# Altium schematic sheet keycontrol2.SchDoc
size A4
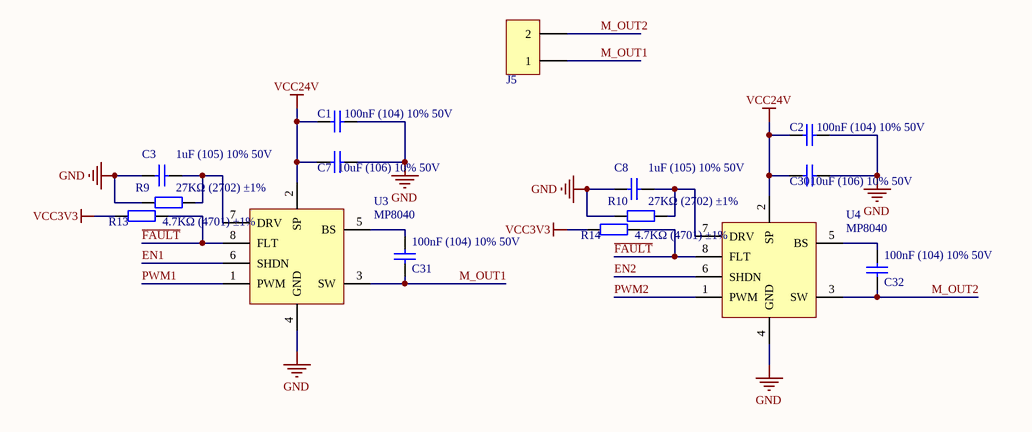
[diagram p0: keycontrol2.SchDoc]

## Parts
C1  100nF (104) 10% 50V  [0603_C]
C2  100nF (104) 10% 50V  [0603_C]
C3  1uF (105) 10% 50V  [0603_C]
C7  10uF (106) 10% 50V  [1206_C]
C8  1uF (105) 10% 50V  [0603_C]
C30  10uF (106) 10% 50V  [1206_C]
C31  100nF (104) 10% 50V  [0603_C]
C32  100nF (104) 10% 50V  [0603_C]
J5  MOTOR  [XH-2P]  (value not drawn)
R9  27KΩ (2702) ±1%  [0603_R]
R10  27KΩ (2702) ±1%  [0603_R]
R13  4.7KΩ (4701) ±1%  [0603_R]
R14  4.7KΩ (4701) ±1%  [0603_R]
U3  MP8040  [SOIC-8_150mil]
U4  MP8040  [SOIC-8_150mil]

## Nets
GND: C1.1 C2.1 C3.1 C7.2 C8.1 C30.2 R9.1 R10.1 U3.4(GND) U4.4(GND)
VCC3V3: R13.1 R14.1
VCC24V: C1.2 C2.2 C7.1 C30.1 U3.2(SP) U4.2(SP)
EN1: U3.6(SHDN)
EN2: U4.6(SHDN)
~{FAULT}: R13.2 R14.2 U3.8(FLT) U4.8(FLT)
M_OUT1: C31.1 J5.1 U3.3(SW)
M_OUT2: C32.1 J5.2 U4.3(SW)
PWM1: U3.1(PWM)
PWM2: U4.1(PWM)
NetC3_2: C3.2 R9.2 U3.7(DRV)
NetC8_2: C8.2 R10.2 U4.7(DRV)
NetC31_2: C31.2 U3.5(BS)
NetC32_2: C32.2 U4.5(BS)

## Library data of the parts
C1 C2 C31 C32 = 0603 100nF (104) 10% 50V: 贴片电容; ComponentLink1Description: 供应商链接; ComponentLink1URL: http://www.szlcsc.com/product/details_15331.html; Package: 0603; Supplier: LC; SuppliersPartNumber: C14663
C3 C8 = 0603 1uF (105) 10% 50V: 贴片电容; ComponentLink1Description: 供应商链接; ComponentLink1URL: http://www.szlcsc.com/product/details_16531.html; Package: 0603; Supplier: LC; SuppliersPartNumber: C15849
C7 C30 = 1206 10uF (106) 10% 50V: 贴片电容; ComponentLink1Description: 供应商链接; ComponentLink1URL: http://www.szlcsc.com/product/details_14236.html; Package: 1206; Supplier: LC; SuppliersPartNumber: C13585
J5 = header2
R9 R10 = 0603 27KΩ (2702) 1%: 贴片电阻; ComponentLink1Description: 供应商链接; ComponentLink1URL: http://www.szlcsc.com/product/details_23694.html; Package: 0603; Supplier: LC; SuppliersPartNumber: C22967
R13 R14 = 0603 4.7KΩ (4701) 1%: 贴片电阻; ComponentLink1Description: 供应商链接; ComponentLink1URL: http://www.szlcsc.com/product/details_23889.html; Package: 0603; Supplier: LC; SuppliersPartNumber: C23162
U3 U4 = MP8040DN-LF-Z: half bridge power driver